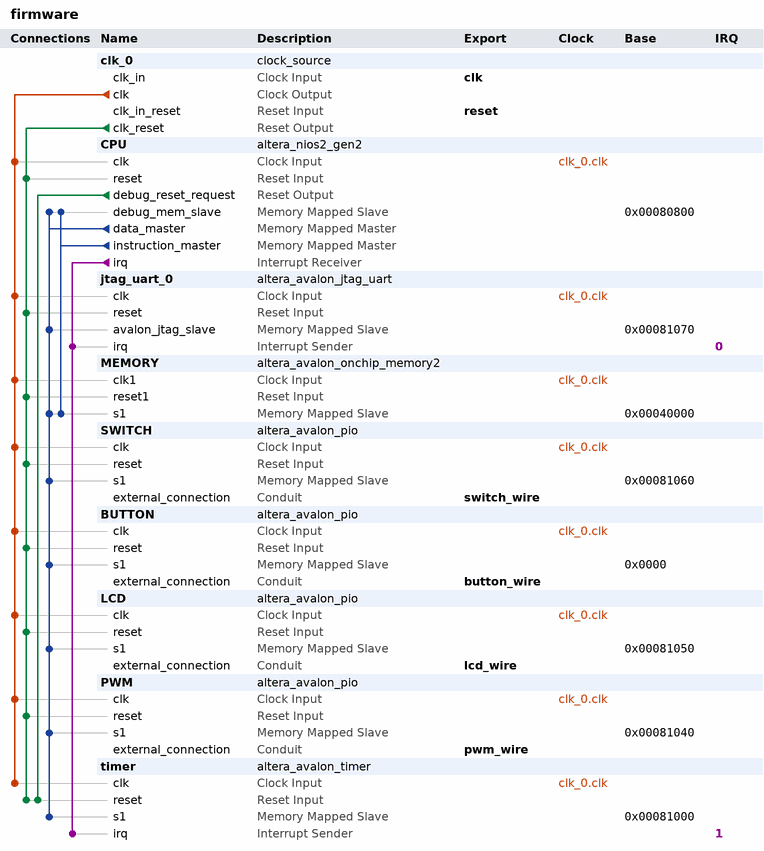
[diagram p0: system contents]
# Platform Designer (Qsys) system firmware, Cyclone V 5CSXFC6D6F31C6
# Parameters at their usual value, and those the tool derives, are not listed.
package require -exact qsys 18.1
create_system firmware
set_project_property DEVICE_FAMILY {Cyclone V}
set_project_property DEVICE 5CSXFC6D6F31C6

add_instance clk_0 clock_source 18.1
set_instance_parameter_value clk_0 clockFrequency 50000000

add_instance CPU altera_nios2_gen2 18.1
set_instance_parameter_value CPU dcache_size 2048
set_instance_parameter_value CPU exceptionSlave MEMORY.s1
set_instance_parameter_value CPU icache_size 4096
set_instance_parameter_value CPU impl Fast
set_instance_parameter_value CPU resetSlave MEMORY.s1

add_instance jtag_uart_0 altera_avalon_jtag_uart 18.1
set_instance_parameter_value jtag_uart_0 simInteractiveOptions NO_INTERACTIVE_WINDOWS

add_instance MEMORY altera_avalon_onchip_memory2 18.1
set_instance_parameter_value MEMORY dataWidth 32
set_instance_parameter_value MEMORY dualPort false
set_instance_parameter_value MEMORY initMemContent true
set_instance_parameter_value MEMORY initializationFileName onchip_mem.hex
set_instance_parameter_value MEMORY memorySize 204800

add_instance SWITCH altera_avalon_pio 18.1
set_instance_parameter_value SWITCH direction Input
set_instance_parameter_value SWITCH width 10

add_instance BUTTON altera_avalon_pio 18.1
set_instance_parameter_value BUTTON direction Input
set_instance_parameter_value BUTTON width 4

add_instance LCD altera_avalon_pio 18.1
set_instance_parameter_value LCD direction Output
set_instance_parameter_value LCD width 10

add_instance PWM altera_avalon_pio 18.1
set_instance_parameter_value PWM direction Output
set_instance_parameter_value PWM width 2

add_instance timer altera_avalon_timer 18.1
set_instance_parameter_value timer counterSize 64
set_instance_parameter_value timer period 1
set_instance_parameter_value timer periodUnits USEC

# connections
add_connection clk_0.clk BUTTON.clk clock
add_connection clk_0.clk CPU.clk clock
add_connection clk_0.clk jtag_uart_0.clk clock
add_connection clk_0.clk LCD.clk clock
add_connection clk_0.clk MEMORY.clk1 clock
add_connection clk_0.clk PWM.clk clock
add_connection clk_0.clk SWITCH.clk clock
add_connection clk_0.clk timer.clk clock
add_connection clk_0.clk_reset BUTTON.reset reset
add_connection clk_0.clk_reset CPU.reset reset
add_connection clk_0.clk_reset jtag_uart_0.reset reset
add_connection clk_0.clk_reset LCD.reset reset
add_connection clk_0.clk_reset MEMORY.reset1 reset
add_connection clk_0.clk_reset PWM.reset reset
add_connection clk_0.clk_reset SWITCH.reset reset
add_connection clk_0.clk_reset timer.reset reset
add_connection CPU.debug_reset_request timer.reset reset
add_connection CPU.data_master BUTTON.s1 avalon
set_connection_parameter_value CPU.data_master/BUTTON.s1 baseAddress 0x0000
add_connection CPU.data_master CPU.debug_mem_slave avalon
set_connection_parameter_value CPU.data_master/CPU.debug_mem_slave baseAddress 0x00080800
add_connection CPU.data_master jtag_uart_0.avalon_jtag_slave avalon
set_connection_parameter_value CPU.data_master/jtag_uart_0.avalon_jtag_slave baseAddress 0x00081070
add_connection CPU.data_master LCD.s1 avalon
set_connection_parameter_value CPU.data_master/LCD.s1 baseAddress 0x00081050
add_connection CPU.data_master MEMORY.s1 avalon
set_connection_parameter_value CPU.data_master/MEMORY.s1 baseAddress 0x00040000
add_connection CPU.data_master PWM.s1 avalon
set_connection_parameter_value CPU.data_master/PWM.s1 baseAddress 0x00081040
add_connection CPU.data_master SWITCH.s1 avalon
set_connection_parameter_value CPU.data_master/SWITCH.s1 baseAddress 0x00081060
add_connection CPU.data_master timer.s1 avalon
set_connection_parameter_value CPU.data_master/timer.s1 baseAddress 0x00081000
add_connection CPU.instruction_master CPU.debug_mem_slave avalon
set_connection_parameter_value CPU.instruction_master/CPU.debug_mem_slave baseAddress 0x00080800
add_connection CPU.instruction_master MEMORY.s1 avalon
set_connection_parameter_value CPU.instruction_master/MEMORY.s1 baseAddress 0x00040000
add_connection CPU.irq jtag_uart_0.irq interrupt
set_connection_parameter_value CPU.irq/jtag_uart_0.irq irqNumber 0
add_connection CPU.irq timer.irq interrupt
set_connection_parameter_value CPU.irq/timer.irq irqNumber 1

# exported interfaces
add_interface button_wire conduit end
set_interface_property button_wire EXPORT_OF BUTTON.external_connection
add_interface clk clock sink
set_interface_property clk EXPORT_OF clk_0.clk_in
add_interface lcd_wire conduit end
set_interface_property lcd_wire EXPORT_OF LCD.external_connection
add_interface pwm_wire conduit end
set_interface_property pwm_wire EXPORT_OF PWM.external_connection
add_interface reset reset sink
set_interface_property reset EXPORT_OF clk_0.clk_in_reset
add_interface switch_wire conduit end
set_interface_property switch_wire EXPORT_OF SWITCH.external_connection

set_interconnect_requirement {$system} qsys_mm.clockCrossingAdapter HANDSHAKE
set_interconnect_requirement {$system} qsys_mm.enableEccProtection FALSE
set_interconnect_requirement {$system} qsys_mm.insertDefaultSlave FALSE
set_interconnect_requirement {$system} qsys_mm.maxAdditionalLatency 1

save_system firmware.qsys
